# Altium schematic sheet E-scooter.SchDoc
size A
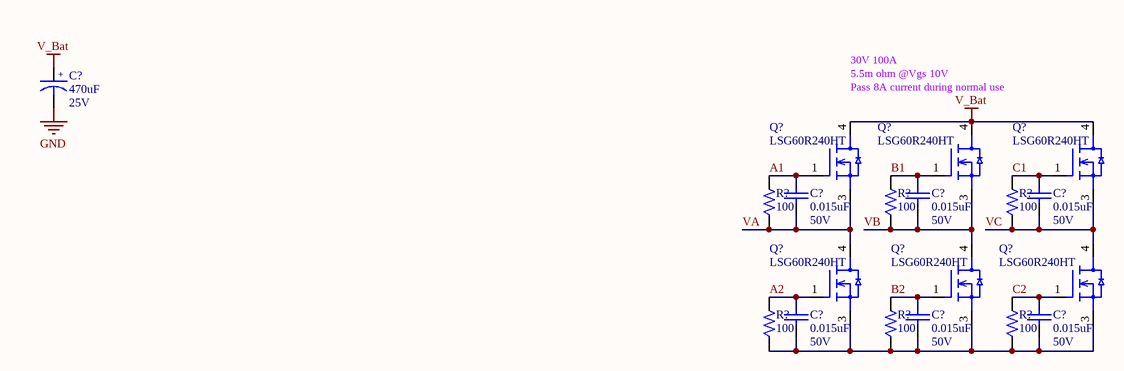
[diagram p0: E-scooter.SchDoc]

## Parts
(Parts that share a designator on the sheet are numbered #1, #2 ... from top to bottom, then left to right.)
C?#1  value 470uF  Voltage: 25V  [CASE - G]  (hidden comment: PBE099550-4710)
C?#2  value 0.015uF  Voltage: 50V  [CAPC0603-RW]  (hidden comment: PXL456470-1530)
C?#3  value 0.015uF  Voltage: 50V  [CAPC0603-RW]  (hidden comment: PXL456470-1530)
C?#4  value 0.015uF  Voltage: 50V  [CAPC0603-RW]  (hidden comment: PXL456470-1530)
C?#5  value 0.015uF  Voltage: 50V  [CAPC0603-RW]  (hidden comment: PXL456470-1530)
C?#6  value 0.015uF  Voltage: 50V  [CAPC0603-RW]  (hidden comment: PXL456470-1530)
C?#7  value 0.015uF  Voltage: 50V  [CAPC0603-RW]  (hidden comment: PXL456470-1530)
Q?#1  MFG Part: LSG60R240HT  [TO252-3]  (hidden comment: T5860038503A6)
Q?#2  MFG Part: LSG60R240HT  [TO252-3]  (hidden comment: T5860038503A6)
Q?#3  MFG Part: LSG60R240HT  [TO252-3]  (hidden comment: T5860038503A6)
Q?#4  MFG Part: LSG60R240HT  [TO252-3]  (hidden comment: T5860038503A6)
Q?#5  MFG Part: LSG60R240HT  [TO252-3]  (hidden comment: T5860038503A6)
Q?#6  MFG Part: LSG60R240HT  [TO252-3]  (hidden comment: T5860038503A6)
R?#1  value 100  [0201]  (hidden comment: T5024421083A9)
R?#2  value 100  [0201]  (hidden comment: T5024421083A9)
R?#3  value 100  [0201]  (hidden comment: T5024421083A9)
R?#4  value 100  [0201]  (hidden comment: T5024421083A9)
R?#5  value 100  [0201]  (hidden comment: T5024421083A9)
R?#6  value 100  [0201]  (hidden comment: T5024421083A9)

## Nets
GND: C?#1.2
V_Bat: C?#1.1 Q?#1.4(D) Q?#2.4(D) Q?#3.4(D)
A1: C?#2.2 Q?#1.1(G) R?#1.2
A2: C?#5.2 Q?#4.1(G) R?#4.2
B1: C?#3.2 Q?#2.1(G) R?#2.2
B2: C?#6.2 Q?#5.1(G) R?#5.2
C1: C?#4.2 Q?#3.1(G) R?#3.2
C2: C?#7.2 Q?#6.1(G) R?#6.2
VA: C?#2.1 Q?#1.3(S) Q?#4.4(D) R?#1.1
VB: C?#3.1 Q?#2.3(S) Q?#5.4(D) R?#2.1
VC: C?#4.1 Q?#3.3(S) Q?#6.4(D) R?#3.1
NetC?#5_1: C?#5.1 C?#6.1 C?#7.1 Q?#4.3(S) Q?#5.3(S) Q?#6.3(S) R?#4.1 R?#5.1 R?#6.1

## Notes on the sheet
- 30V 100A
- 5.5m ohm @Vgs 10V
- (near Q?#2) Pass 8A current during normal use
- (in symbol CAP E 470uF 25V 20% SMD) +

## Library data of the parts
C?#1 = CAP E 470uF 25V 20% SMD: CHIP ELECT 470uF 25V 20% D10xL10 105; SAP: T551471445000; Vendor Name: 东莞市晴远电子有限公司; Vendor Code: 10010262; Type: Capacitor; DIP&SMD: SMD; PACKAGE: CASE - G; MFG: *; MFG Part: *; Other: *; Tolerance: 20%; Customer Specific: N/A
C?#2-C?#7 = CAP0603 0.015uF 50V 10%: GP CHIP CAP 0.015uF 50V 10% 0603 TYPE X7R; SAP: T542021537508; Vendor Code: 10010262; Vendor Name: 东莞市晴远电子有限公司; Type: Capacitor; DIP&SMD: SMD; PACKAGE: CAPC0603; MFG: *; MFG Part: *; Other: X7R; Tolerance: 10%; Customer Specific: N/A
Q?#1-Q?#6 = NMOS LSG60R240HT: NMOS 600V LSG60R240HT TO252( LONTEN K; Current: 17A; Type: N-CHANNEL MOSFET; CREATE_NAME: Nathan; DIP&SMD: SMD; SAP: T5860038503A6; Pd: *; Vendor Code: *; Vendor Name: *; Voltage: 600V; MFG: LONTEN; CREATE_TIME: 12-Oct-2019; Rds: *; Customer Specific: N/A; Package: TO252
R?#1-R?#6 = RES0201 1/20W 1% 4.42K OHM_WALSIN: CHIP 4.42K OHM 200PPM +-1% 0201 WALS L; MFG Part: WR02X4421FAL; Power: 1/20W; MFG: WALSIN (華新); TOL: 1%; CREATE_NAME: Nathan; DIP&SMD: SMD; Vendor Code: *; SAP: T5024421083A9; Vendor Name: *; Type: Resistor; PACKAGE: 0603; CREATE_TIME: 23-July-2019; Customer Specific: N/A